# Altium schematic sheet FPGA_Altera_Cyclone_III_Starter_Kit.SchDoc
size A; DocumentNumber: 1; SheetNumber: 1; SheetTotal: 1
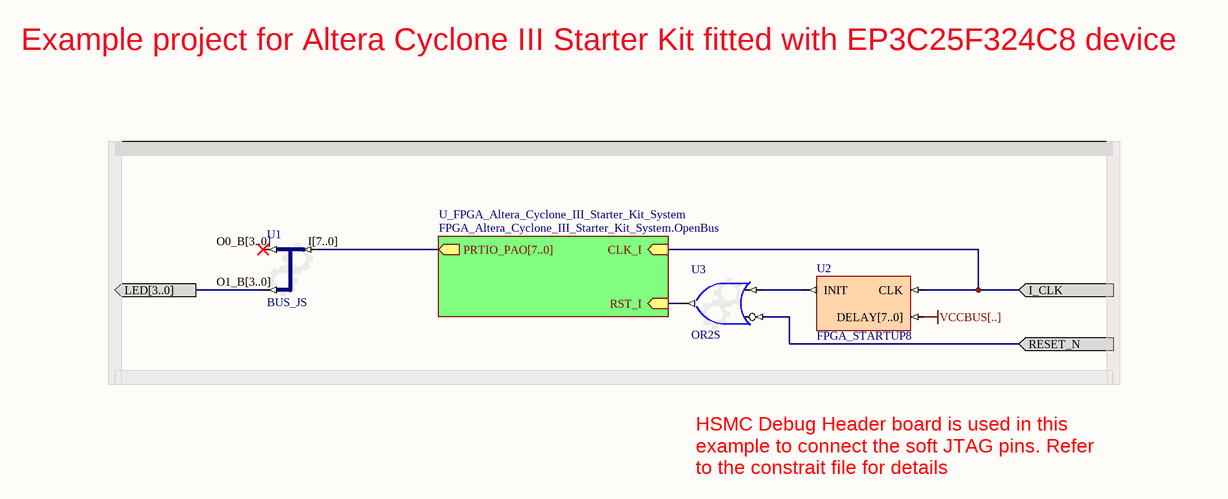
[diagram p0: FPGA_Altera_Cyclone_III_Starter_Kit.SchDoc]

## Parts
U1  BUS_JS
U2  FPGA_STARTUP8
U3  OR2S

## Sub-sheets
U_FPGA_Altera_Cyclone_III_Starter_Kit_System = FPGA_Altera_Cyclone_III_Starter_Kit_System.OpenBus: PRTIO_PAO[7..0] (out), RST_I (in), CLK_I (in)

## Ports
I_CLK (in, see B9), LED[3..0] (out, see N9,N12,P12,P13), RESET_N (in, see N2)

## Nets
VCCBUS[..]: U2.DELAY[7..0]
I_CLK: U2.CLK ; port I_CLK, sheet U_FPGA_Altera_Cyclone_III_Starter_Kit_System/CLK_I
LED[3..0]: U1.O1_B[3..0] ; port LED[3..0]
RESET_N: U3.I1 ; port RESET_N
NetU1_I[7..0]: U1.I[7..0] ; sheet U_FPGA_Altera_Cyclone_III_Starter_Kit_System/PRTIO_PAO[7..0]
NetU2_INIT: U2.INIT U3.I0
NetU3_O: U3.O ; sheet U_FPGA_Altera_Cyclone_III_Starter_Kit_System/RST_I

Not connected (* = marked no-connect by the designer): U1 O0_B[3..0]*

## Notes on the sheet
- Example project for Altera Cyclone III Starter Kit fitted with EP3C25F324C8 device
- HSMC Debug Header board is used in this example to connect the soft JTAG pins. Refer to the constrait file for details
- Title
- Size:
- Date:
- A
- Number:
- Time:
- Revision:
- Sheet
- of
- File:

## Library data of the parts
U1 = BUS_JS: Configurable Bus Joiner/Splitter; ConfiguratorName: GENERIC_BUS_JS; ConfigurationParameters: {}Version[1.1]{}SplitterJoinerType[Splitter]{}SignalCount[2]{}SignalWidth0[4]{}GapBelow0[3000000]{}ConnectionType0[Pin]{}SignalWidth1[4]{}GapBelow1[1000000]{}ConnectionType1[Pin]{}ShowPinNames[True]{}; LastRevisionNo: 1.00.00; Published: 17-Sep-2008; Publisher: Altium Limited
U2 = FPGA_STARTUP8: FPGA Startup With 8 Bit Delay; Published: 9-Dec-2004; Publisher: Altium Limited; HelpURL: CR0119 FPGA_STARTUPx Powerup Delay Unit.pdf; LastRevisionNo: 1.00.00; ComponentLink1Description: Core &Resource Usage; ComponentLink1URL: CR0139 FPGA Peripheral Resource Usage.pdf#page=11
U3 = GATE: Configurable Generic Gate; ConfiguratorName: GENERIC_GATE; ConfigurationParameters: {}Version[1.1]{}GateKind[OR]{}BusInput[False]{}GateInputType[Bit]{}GateOutputOption[Normal]{}BusWidth[8]{}RegisterOutputs[False]{}NegativeClockEdge[False]{}InputCount[2]{}InputInvert0[False]{}InputInvert1[True]{}; LastRevisionNo: 1.00.00; Published: 3-Sep-2008; Publisher: Altium Limited